# Altium schematic sheet SPI_Relays.SchDoc
size A
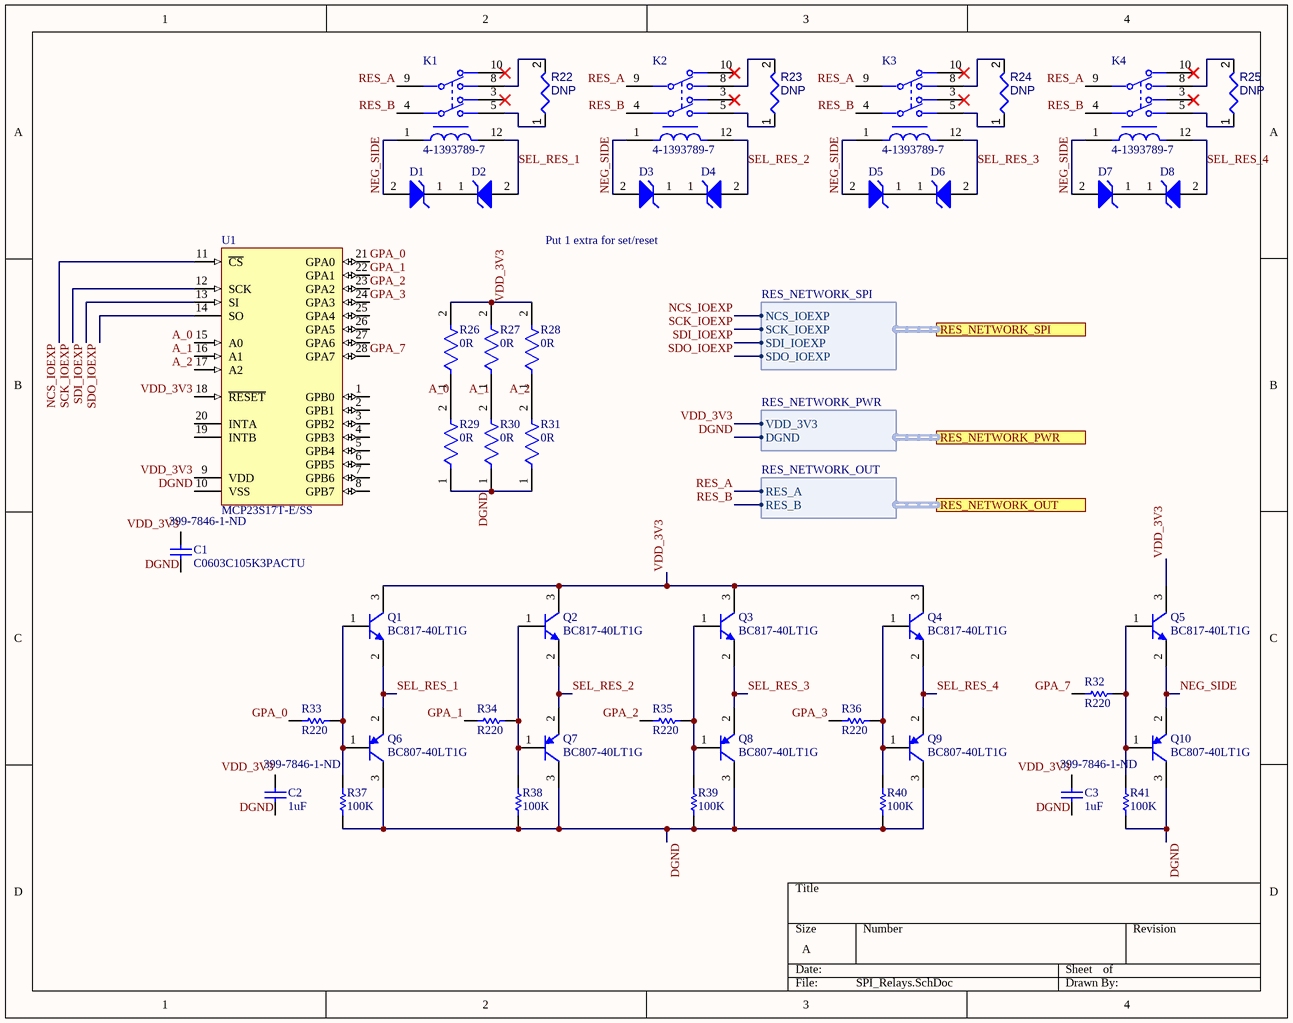
[diagram p0: SPI_Relays.SchDoc]

## Parts
C1  C0603C105K3PACTU  Supplier Part Number 1: 399-7846-1-ND  [CAPC1608X95X35LL15T15]
C2  1uF  Supplier Part Number 1: 399-7846-1-ND  [CAPC1608X95X35LL15T15]
C3  1uF  Supplier Part Number 1: 399-7846-1-ND  [CAPC1608X95X35LL15T15]
D1  SZMM3Z6V2T1G  [ONSC-SOD-323-2-477-02_V]  (value not drawn)
D2  SZMM3Z6V2T1G  [ONSC-SOD-323-2-477-02_V]  (value not drawn)
D3  SZMM3Z6V2T1G  [ONSC-SOD-323-2-477-02_V]  (value not drawn)
D4  SZMM3Z6V2T1G  [ONSC-SOD-323-2-477-02_V]  (value not drawn)
D5  SZMM3Z6V2T1G  [ONSC-SOD-323-2-477-02_V]  (value not drawn)
D6  SZMM3Z6V2T1G  [ONSC-SOD-323-2-477-02_V]  (value not drawn)
D7  SZMM3Z6V2T1G  [ONSC-SOD-323-2-477-02_V]  (value not drawn)
D8  SZMM3Z6V2T1G  [ONSC-SOD-323-2-477-02_V]  (value not drawn)
K1  4-1393789-7  [FP-4-1393789-7-MFG]
K2  4-1393789-7  [FP-4-1393789-7-MFG]
K3  4-1393789-7  [FP-4-1393789-7-MFG]
K4  4-1393789-7  [FP-4-1393789-7-MFG]
Q1  BC817-40LT1G  [ONSC-SOT-23-3-318-08_V]
Q2  BC817-40LT1G  [ONSC-SOT-23-3-318-08_V]
Q3  BC817-40LT1G  [ONSC-SOT-23-3-318-08_V]
Q4  BC817-40LT1G  [ONSC-SOT-23-3-318-08_V]
Q5  BC817-40LT1G  [ONSC-SOT-23-3-318-08_V]
Q6  BC807-40LT1G  [ONSC-SOT-23-3-318-08_V]
Q7  BC807-40LT1G  [ONSC-SOT-23-3-318-08_V]
Q8  BC807-40LT1G  [ONSC-SOT-23-3-318-08_V]
Q9  BC807-40LT1G  [ONSC-SOT-23-3-318-08_V]
Q10  BC807-40LT1G  [ONSC-SOT-23-3-318-08_V]
R22  DNP  [RESC1608X55X25ML10T15]
R23  DNP  [RESC1608X55X25ML10T15]
R24  DNP  [RESC1608X55X25ML10T15]
R25  DNP  [RESC1608X55X25ML10T15]
R26  0R  [FP-CR0603-MFG]
R27  0R  [FP-CR0603-MFG]
R28  0R  [FP-CR0603-MFG]
R29  0R  [FP-CR0603-MFG]
R30  0R  [FP-CR0603-MFG]
R31  0R  [FP-CR0603-MFG]
R32  R220  [RESC1609X50X30LL10T20]
R33  R220  [RESC1609X50X30LL10T20]
R34  R220  [RESC1609X50X30LL10T20]
R35  R220  [RESC1609X50X30LL10T20]
R36  R220  [RESC1609X50X30LL10T20]
R37  100K  [RESC1608X55X25ML10T15]
R38  100K  [RESC1608X55X25ML10T15]
R39  100K  [RESC1608X55X25ML10T15]
R40  100K  [RESC1608X55X25ML10T15]
R41  100K  [RESC1608X55X25ML10T15]
U1  MCP23S17T-E/SS  [SSOP-SS28_M]

## Ports
RES_NETWORK_OUT (harness RES_NETWORK_OUT), RES_NETWORK_PWR (harness RES_NETWORK_PWR), RES_NETWORK_SPI (harness RES_NETWORK_SPI)

## Harnesses
RES_NETWORK_SPI: NCS_IOEXP, SCK_IOEXP, SDI_IOEXP, SDO_IOEXP
RES_NETWORK_PWR: VDD_3V3, DGND
RES_NETWORK_OUT: RES_A, RES_B

## Nets
A_0: R26.1 R29.2 U1.15(A0)
A_1: R27.1 R30.2 U1.16(A1)
A_2: R28.1 R31.2 U1.17(A2)
DGND: C1.1 C2.1 C3.1 Q6.3(C) Q7.3(C) Q8.3(C) Q9.3(C) Q10.3(C) R29.1 R30.1 R31.1 R37.1 R38.1 R39.1 R40.1 R41.1 U1.10(VSS) ; port RES_NETWORK_PWR.DGND
GPA_0: R33.1 U1.21(GPA0)
GPA_1: R34.1 U1.22(GPA1)
GPA_2: R35.1 U1.23(GPA2)
GPA_3: R36.1 U1.24(GPA3)
GPA_7: R32.1 U1.28(GPA7)
NCS_IOEXP: U1.11(~{CS}) ; port RES_NETWORK_SPI.NCS_IOEXP
NEG_SIDE: D1.2(A) D3.2(A) D5.2(A) D7.2(A) K1.1 K2.1 K3.1 K4.1 Q5.2(E) Q10.2(E)
RES_A: K1.9 K2.9 K3.9 K4.9 ; port RES_NETWORK_OUT.RES_A
RES_B: K1.4 K2.4 K3.4 K4.4 ; port RES_NETWORK_OUT.RES_B
SCK_IOEXP: U1.12(SCK) ; port RES_NETWORK_SPI.SCK_IOEXP
SDI_IOEXP: U1.13(SI) ; port RES_NETWORK_SPI.SDI_IOEXP
SDO_IOEXP: U1.14(SO) ; port RES_NETWORK_SPI.SDO_IOEXP
SEL_RES_1: D2.2(A) K1.12 Q1.2(E) Q6.2(E)
SEL_RES_2: D4.2(A) K2.12 Q2.2(E) Q7.2(E)
SEL_RES_3: D6.2(A) K3.12 Q3.2(E) Q8.2(E)
SEL_RES_4: D8.2(A) K4.12 Q4.2(E) Q9.2(E)
VDD_3V3: C1.2 C2.2 C3.2 Q1.3(C) Q2.3(C) Q3.3(C) Q4.3(C) Q5.3(C) R26.2 R27.2 R28.2 U1.9(VDD) U1.18(~{RESET}) ; port RES_NETWORK_PWR.VDD_3V3
NetD1_1: D1.1(K) D2.1(K)
NetD3_1: D3.1(K) D4.1(K)
NetD5_1: D5.1(K) D6.1(K)
NetD7_1: D7.1(K) D8.1(K)
NetK1_5: K1.5 R22.1
NetK1_8: K1.8 R22.2
NetK2_5: K2.5 R23.1
NetK2_8: K2.8 R23.2
NetK3_5: K3.5 R24.1
NetK3_8: K3.8 R24.2
NetK4_5: K4.5 R25.1
NetK4_8: K4.8 R25.2
NetQ1_1: Q1.1(B) Q6.1(B) R33.2 R37.2
NetQ2_1: Q2.1(B) Q7.1(B) R34.2 R38.2
NetQ3_1: Q3.1(B) Q8.1(B) R35.2 R39.2
NetQ4_1: Q4.1(B) Q9.1(B) R36.2 R40.2
NetQ5_1: Q5.1(B) Q10.1(B) R32.2 R41.2

Not connected (* = marked no-connect by the designer): K1 3* 10*; K2 3* 10*; K3 3* 10*; K4 3* 10*; U1 1(GPB0) 2(GPB1) 3(GPB2) 4(GPB3) 5(GPB4) 6(GPB5) 7(GPB6) 8(GPB7) 19(INTB) 20(INTA) 25(GPA4) 26(GPA5) 27(GPA6)

## Notes on the sheet
- Put 1 extra for set/reset

## Library data of the parts
C1 = CMP-2006-02216-1: Manufacturer: Kemet; Description: KEMET - C0603C105K3PACTU - SMD Multilayer Ceramic Capacitor, 1 µF, 25 V, 0603 [1608 Metric], ± 10%, X5R, C Series KEMET; Dielectric Material: Ceramic; Capacitance: 1uF; Tolerance: 10%; Dielectric: X5R; Voltage Rating (DC): 25V; Part Number: C0603C105K3PACTU; Supplier 1: Digi-Key; Manufacturer Part Number: C0603C105K3PACTU; RoHS: Yes; Category: Ceramic Capacitors; Stock 1: 157618; Pricing 1: 1=0.18000, 10=0.12700, 50=0.07220, 100=0.05980, 500=0.04194, 1000=0.03472 (USD); Mount: Surface Mount; Case/Package: 0603; Contact Plating: Tin,Matte; Min Operating Temperature: -55°C; Max Operating Temperature: 85°C; Packaging: Tape and Reel; Voltage: 25V; Termination: SMD/SMT; Length: 1.6mm; Height: 0.8mm; Depth: 0.8mm; Radiation Hardening: No; Lead Free: Lead Free; ComponentLink1URL: https://datasheet.ciiva.com/28610/1918694-28610792.pdf?src-supplier=Element14; ComponentLink1Description: https://datasheet.ciiva.com/28610/1918694-28610792.pdf?src-supplier=Element14; ComponentLink2URL: https://datasheet.ciiva.com/5998/40889-5998745.pdf?src-supplier=Farnell; ComponentLink2Description: https://datasheet.ciiva.com/5998/40889-5998745.pdf?src-supplier=Farnell; Supplier Unit Price 1: 0.18
C2 C3 = CMP-2006-02216-1: Manufacturer: Kemet; Part Number: C0603C105K3PACTU; Description: KEMET - C0603C105K3PACTU - SMD Multilayer Ceramic Capacitor, 1 µF, 25 V, 0603 [1608 Metric], ± 10%, X5R, C Series KEMET; Dielectric Material: Ceramic; Tolerance: 10%; Dielectric: X5R; Voltage Rating (DC): 25V; Supplier 1: Digi-Key; Manufacturer Part Number: C0603C105K3PACTU; RoHS: Yes; Category: Ceramic Capacitors; Stock 1: 157618; Pricing 1: 1=0.18000, 10=0.12700, 50=0.07220, 100=0.05980, 500=0.04194, 1000=0.03472 (USD); Mount: Surface Mount; Case/Package: 0603; Contact Plating: Tin,Matte; Min Operating Temperature: -55°C; Max Operating Temperature: 85°C; Capacitance: 1uF; Packaging: Tape and Reel; Voltage: 25V; Termination: SMD/SMT; Length: 1.6mm; Height: 0.8mm; Depth: 0.8mm; Radiation Hardening: No; Lead Free: Lead Free; ComponentLink1URL: https://datasheet.ciiva.com/28610/1918694-28610792.pdf?src-supplier=Element14; ComponentLink1Description: https://datasheet.ciiva.com/28610/1918694-28610792.pdf?src-supplier=Element14; ComponentLink2URL: https://datasheet.ciiva.com/5998/40889-5998745.pdf?src-supplier=Farnell; ComponentLink2Description: https://datasheet.ciiva.com/5998/40889-5998745.pdf?src-supplier=Farnell; Supplier Unit Price 1: 0.18
D1-D8 = CMP-1060-00701-1: Zener Voltage Regulator, 300 mW, 2-Pin SOD-323, Pb-Free, Tape and Reel; Manufacturer: On Semiconductor; VZ Typ (V): 6.2; P Max (W): 0.3; ComponentLink1Description: Manufacturer URL; Packing: Tape and Reel; PackageReference: SOD-323-2-477-02; PackageDescription: 2-Pin SOD, Body 1.7 x 1.25 mm; RoHS: Pb-Free; PackageVersion: Rev. H, 03/2007; ComponentLink1URL: http://www.onsemi.com/; ComponentLink2URL: http://www.onsemi.cn/pub_link/Collateral/MM3Z2V4T1-D.PDF; Mounting Technology: Surface Mount; DatasheetVersion: Rev. 9; PartNumber: SZMM3Z6V2T1G; ComponentLink2Description: Datasheet; ComponentLink3Description: Package Specification; ComponentLink3URL: http://www.onsemi.com/pub_link/Collateral/477-02.PDF.1
K1-K4 = CMP-03396-000019-1: RELAY GEN PURPOSE DPDT 2A 3VDC; Manufacturer: TE; Number Of Contacts: 2; Coil Type: Non-Latching; Switching Current: 5A; Coil Power: 200mW; Coil Resistance: 45Ω; Switching Power: 60W; Coil Voltage: 3V; Device Class L3: Signal Relays; Temperature: -40°C to +85°C; Height: 10.05mm; Ambient Temperature Range High: +85°C; Automotive: No; Category: Relay; Device Class L1: Electromechanical; Throw Configuration: DPDT; Digikey Description: RELAY GEN PURPOSE DPDT 2A 3VDC; Temperature Range Low: -40°C; RoHS: TRUE; Temperature Range High: +85°C; ComponentLink2Description: Datasheet; Lead Free: Yes; Current Rating: 2A; Device Class L2: Relays; ComponentLink2URL: https://www.te.com/usa-en/product-4-1393789-7.html?te_bu=Cor&te_type=other&te_campaign=oct_glo_cor-oct-global-oth-prtnr-fy19-oct-octo-buy-bom_sma-298_2&elqCampaignId=35216; Package: 4-1393789-7; Manufacturer Part Number: 4-1393789-7; Octopart: https://octopart.com/4-1393789-7-te+connectivity-40938501; Ambient Temperature Range Low: -40°C
Q1-Q5 = CMP-1048-00019-1: General Purpose Transistor, NPN Silicon, 3-Pin SOT-23, Pb-Free, Tape and Reel; Manufacturer: On Semiconductor; fT Min (MHz): 100; IC Continuous (A): 0.5; ComponentLink2URL: http://www.onsemi.com/pub_link/Collateral/BC817-16LT1-D.PDF; DatasheetVersion: Rev. 12; ComponentLink3URL: http://www.onsemi.cn/pub_link/Collateral/318-08.PDF; ComponentLink3Description: Package Specification; ComponentLink1Description: Manufacturer URL; Mounting Technology: Surface Mount; ComponentLink1URL: http://www.onsemi.com/; Packing: Tape and Reel; ComponentLink2Description: Datasheet; Polarity: NPN; RoHS: TRUE; PackageVersion: Rev. AP, 11/2009; PartNumber: BC817-40LT1G; PackageDescription: 3-Pin Small Outline Transistor, Body 2.92 x 1.3 mm, Pitch 0.95 mm; PackageReference: SOT-23-3-318-08
Q6-Q10 = CMP-1048-00745-1: General Purpose Transistor, PNP Silicon, 3-Pin SOT-23, Pb-Free, Tape and Reel; Manufacturer: On Semiconductor; fT Min (MHz): 100; IC Continuous (A): -0.5; Mounting Technology: Surface Mount; ComponentLink3URL: http://www.onsemi.cn/pub_link/Collateral/318-08.PDF; PartNumber: BC807-40LT1G; DatasheetVersion: Rev. 10; RoHS: TRUE; ComponentLink1URL: http://www.onsemi.com/; ComponentLink2URL: http://www.onsemi.com/pub_link/Collateral/BC807-16LT1-D.PDF; ComponentLink1Description: Manufacturer URL; ComponentLink3Description: Package Specification; PackageVersion: Rev. AP, 11/2009; PackageReference: SOT-23-3-318-08; PackageDescription: 3-Pin Small Outline Transistor, Body 2.92 x 1.3 mm, Pitch 0.95 mm; Packing: Tape and Reel; Polarity: PNP; ComponentLink2Description: Datasheet
R22-R25 = CMP-009-00023-4: do not place
R26-R31 = CMP-07231-000023-1: Thick Film Chip Resistors 0603 0Ω 0.1W 5%; Power Rating: 100mW; Resistance: 0mR; Voltage Rating (DC): 50V; Tolerance: 1%; Temperature Coefficient: 500ppm/°C; Depth: 0.8mm; Height: 0.45mm; Case Code (Metric): 1608; Number of Pins: 2; Max Operating Temperature: 155°C; Mount: Surface Mount; REACH SVHC: No SVHC; Radiation Hardening: No; Width: 0.8mm; Max Power Dissipation: 100mW; Thickness: 457um; Package Quantity: 5000; Composition: Thick Film; Case/Package: 0603; Military Standard: Not; Packaging: Tape and Reel; Voltage Rating: 50V; Case Code (Imperial): 0603; Min Operating Temperature: -55°C; Contact Plating: Tin; Length: 1.6mm; Termination: SMD/SMT
R32-R36 = CMP-2000-03085-1: Part Number: CRCW0603220RFKEA; Manufacturer: Vishay Dale
R37-R41 = CMP-2100-03662-1: Chip Resistor, 100 KOhm, +/- 1%, 0.1 W, -55 to 155 degC, 0603 (1608 Metric), RoHS, Tape and Reel; Manufacturer: Yageo; Power Rating: 100mW; Voltage Rating: 50V; Temperature Coefficient: 100ppm/degreesC; Datasheet Version: Rev. 5, 10/2016; Height: 0.45mm; Lead Free: LeadFree; Manufacturer URL: http://www.yageo.com/; Package Reference: 0603; Depth: 0.8mm; RoHSCompliant: true; Composition: ThickFilm; Military Standard: Not; Resistance: 100KOhm; Case/Package: 0603; Packaging: TapeandReel; Case Code (Imperial): 0603; Voltage Rating (DC): 50V; Case Code (Metric): 1608; Tolerance: 1%; Termination: SMD/SMT; Min Operating Temperature: -55degC; Number of Pins: 2; Length: 1.6mm; Width: 0.8mm; Datasheet URL: http://www.yageo.com/NewPortal/yageodocoutput?fileName=/pdf/R-Chip/PYu-RC_Group_51_RoHS_L_5.pdf; Package Description: 2-Pin Surface Mount Device, Body 1.6 x 0.8 mm; Max Operating Temperature: 155degC; REACH SVHC: NoSVHC
U1 = CMP-0186-00173-2: 16-Bit I/O Expander with Serial Interface, 28-Pin SSOP, Extended Temperature, Tape and Reel; RevisionNote: URLs added. Sch pin type corrected.; PackageVersion: revBB, Aug-2009; DatasheetVersion: revB, Feb-2007; ComponentLink3Description: Package Specification; PackageDescription: 28-Lead Plastic Shrink Small Outline (SS) - 5.3mm Body [SSOP]; ComponentLink2Description: Datasheet; ComponentLink2URL: http://ww1.microchip.com/downloads/en/DeviceDoc/21952b.pdf; PackageReference: SSOP-SS28; ComponentLink1Description: Manufacturer URL; ComponentLink3URL: http://www.microchip.com/stellent/groups/techpub_sg/documents/packagingspec/en012702.pdf; ComponentLink1URL: http://www.microchip.com/; Code_JEDEC: MS-150